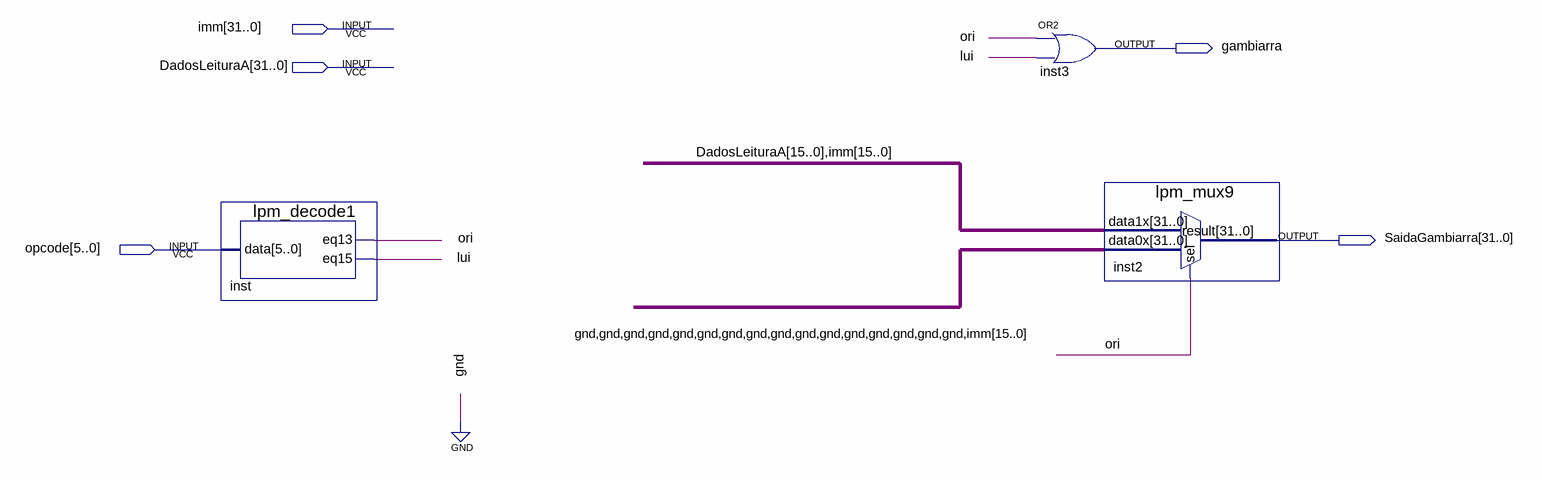
[diagram p0: schematic sheet]
// Quartus schematic Gambiarraluiori.bdf as structural Verilog: 3 symbols, 5 pins
module Gambiarraluiori (
  input  [31:0] imm,
  input  [31:0] DadosLeituraA,
  input  [5:0] opcode,
  output gambiarra,
  output [31:0] SaidaGambiarra
);

  wire lui, ori;

  lpm_decode1 inst (.data(opcode), .eq13(ori), .eq15(lui));
  or inst3 (gambiarra, ori, lui);
  lpm_mux9 inst2 (
    .data1x({DadosLeituraA[15:0], imm[15:0]}), .data0x({{16{1'b0}}, imm[15:0]}), .sel(ori),
    .result(SaidaGambiarra));
endmodule
